# Altium project Gateway.PrjPcb
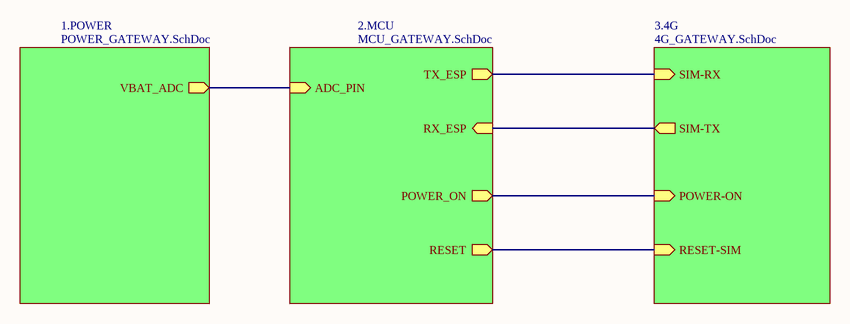
[diagram p0: Gateway.SchDoc]
2 sheets, 53 parts. Net scope: hierarchical (ports join the sheet entries above them; power ports are global).
Board file: Gateway.PcbDoc
Sheets:
  Gateway.SchDoc
    3.4G = 4G_GATEWAY.SchDoc

## Sheet Gateway.SchDoc
size A

### Sub-sheets
1.POWER = POWER_GATEWAY.SchDoc (file not in this document): VBAT_ADC (out)
2.MCU = MCU_GATEWAY.SchDoc (file not in this document): ADC_PIN (in), TX_ESP (out), RX_ESP (in), POWER_ON (out), RESET (out)
3.4G = 4G_GATEWAY.SchDoc: SIM-RX (in), SIM-TX (out), POWER-ON (in), RESET-SIM (in)

### Nets
NetIC1_1: sheet 2.MCU/TX_ESP, sheet 3.4G/SIM-RX
NetIC1_8: sheet 2.MCU/RX_ESP, sheet 3.4G/SIM-TX
NetR8_2: sheet 2.MCU/RESET, sheet 3.4G/RESET-SIM
NetR10_2: sheet 2.MCU/POWER_ON, sheet 3.4G/POWER-ON
(unnamed): sheet 1.POWER/VBAT_ADC, sheet 2.MCU/ADC_PIN

## Sheet 4G_GATEWAY.SchDoc
size A4
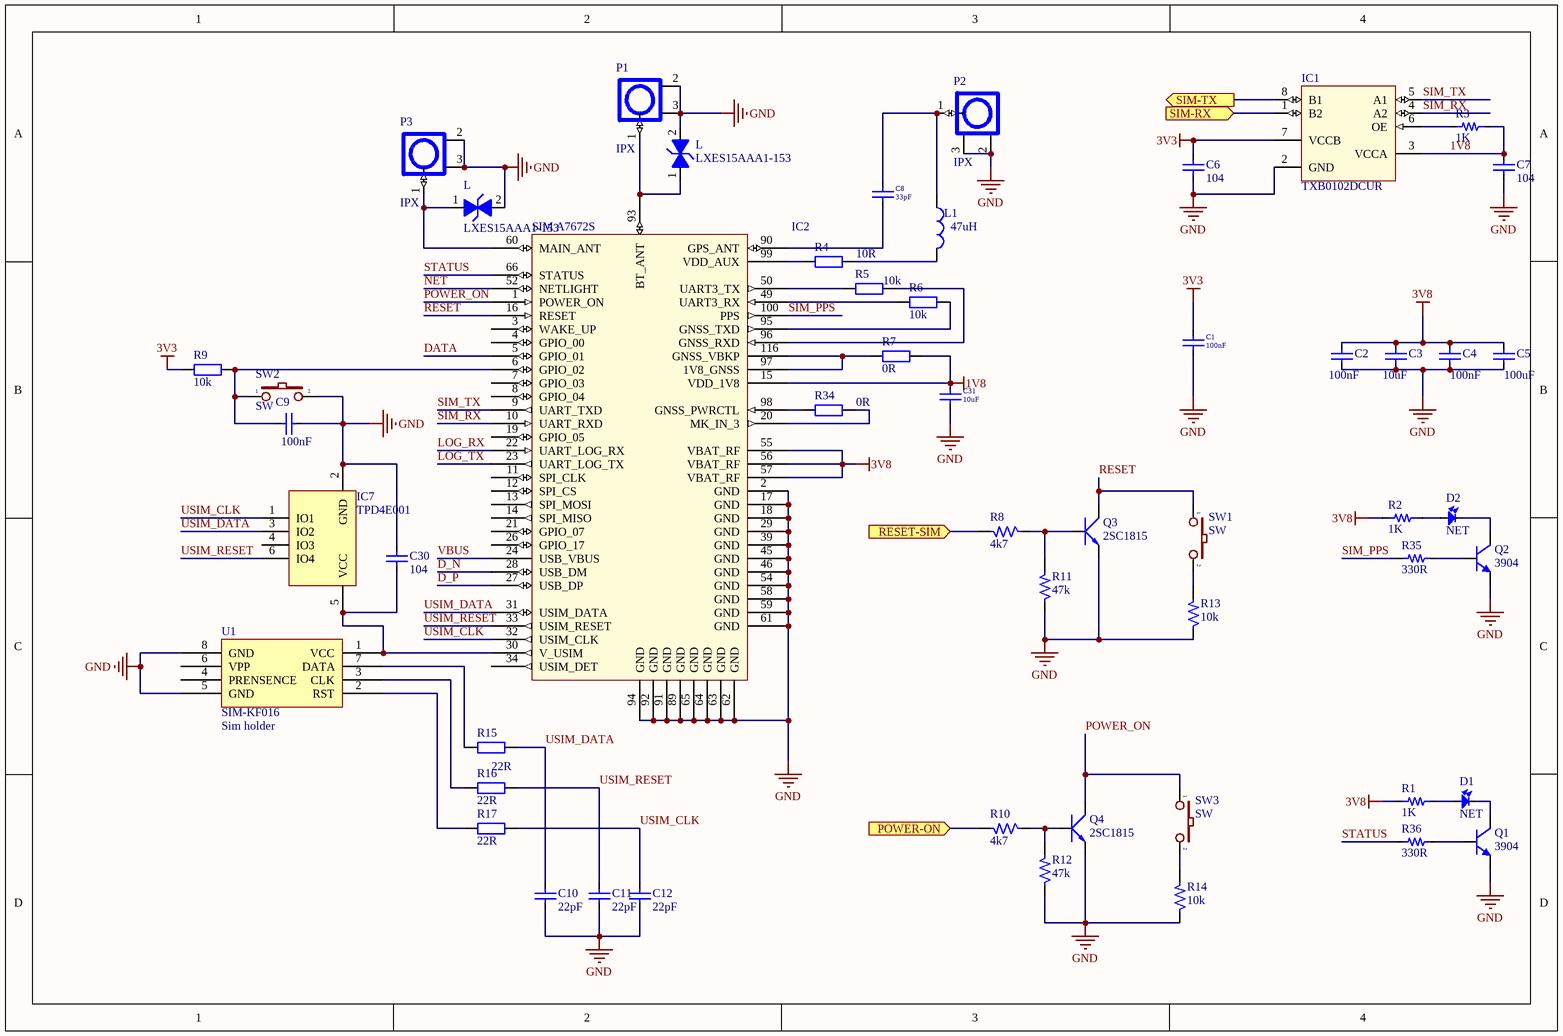
[diagram p1: 4G_GATEWAY.SchDoc]

### Parts
(Parts that share a designator on the sheet are numbered #1, #2 ... from top to bottom, then left to right.)
C1  100nF  [CAP_0805]
C2  100nF  [CAP_0805]
C3  10uF  [CAP_0805]
C4  100nF  [CAP_0805]
C5  100uF  [CAP_0805]
C6  104  [CAP_0805]
C7  104  [CAP_0805]
C8  33pF  [CAP_0805]
C9  100nF  [CAP_0805]
C10  22pF  [CAP_0805]
C11  22pF  [CAP_0805]
C12  22pF  [CAP_0805]
C30  104  [CAP_0805]
C31  10uF  [CAP_0805]
D1  NET  [LED-0805-Blue]
D2  NET  [LED-0805-Blue]
IC1  TXB0102DCUR  [SOP50P310X90-8N]
IC2  SIM A7672S  [A7672S]
IC7  TPD4E001  [SOT23-6]
L1  47uH  [Inductor_SMD]
L#1  LXES15AAA1-153  [INDC1005X45]
L#2  LXES15AAA1-153  [INDC1005X45]
P1  IPX  [IPXS]
P2  IPX  [IPXS]
P3  IPX  [IPXS]
Q1  3904  [SOT23]
Q2  3904  [SOT23]
Q3  2SC1815  [SOT23]
Q4  2SC1815  [SOT23]
R1  1K  [RES-SMD-0805]
R2  1K  [RES-SMD-0805]
R3  1K  [RES-SMD-0805]
R4  10R  [RES-SMD-0805]
R5  10k  [RES-SMD-0805]
R6  10k  [RES-SMD-0805]
R7  0R  [RES-SMD-0805]
R8  4k7  [RES-SMD-0805]
R9  10k  [RES-SMD-0805]
R10  4k7  [RES-SMD-0805]
R11  47k  [RES-SMD-0805]
R12  47k  [RES-SMD-0805]
R13  10k  [RES-SMD-0805]
R14  10k  [RES-SMD-0805]
R15  22R  [RES-SMD-0805]
R16  22R  [RES-SMD-0805]
R17  22R  [RES-SMD-0805]
R34  0R  [RES-SMD-0805]
R35  330R  [RES-SMD-0805]
R36  330R  [RES-SMD-0805]
SW1  SW  [SW-SMD]
SW2  SW  [SW-SMD]
SW3  SW  [SW-SMD]
U1  SIM-KF016  value Sim holder  [SIM_MicroSIM 6P Flip]

### Ports
POWER-ON (in), RESET-SIM (in), SIM-RX (in), SIM-TX (out)

### Nets
1V8: C7.2 C31.2 IC1.3(VCCA) IC2.15(RESERVED) R3.2 R7.1
3V3: C1.2 C6.2 IC1.7(VCCB) R9.2
3V8: C2.2 C3.2 C4.2 C5.2 IC2.55(VBAT_RF) IC2.56(VBAT_RF) IC2.57(VBAT_RF) R1.1 R2.1
GND: C1.1 C2.1 C3.1 C4.1 C5.1 C6.1 C7.1 C9.1 C10.2 C11.2 C12.2 C30.1 C31.1 IC1.2(GND) IC2.2(GND) IC2.17(GND) IC2.18(GND) IC2.29(KEYPAD_0) IC2.39(GND) IC2.45(GND) IC2.46(ADC2) IC2.54(GPIO4) IC2.58(GND) IC2.59(GND) IC2.61(GND) IC2.62(GND) IC2.63(GND) IC2.64(GND) IC2.65(GND) IC2.89(GND) IC2.91(GND) IC2.92(GND) IC2.94(GND) IC7.2(GND) L#1.2 L#2.2 P1.2 P1.3 P2.2 P2.3 P3.2 P3.3 Q1.2(E) Q2.2(E) Q3.1(E) Q4.1(E) R11.1 R12.1 R13.1 R14.1 SW2.2 U1.5(GND) U1.8(GND)
D_N: IC2.28(KEYSENSE_N0)
D_P: IC2.27(KEYSENSE_N1)
DATA: IC2.5(GPIO_01)
LOG_RX: IC2.22(SPK_P)
LOG_TX: IC2.23(MIC1P)
NET: IC2.52(GPIO41)
POWER_ON: IC2.1(POWER_ON) Q4.2(C) SW3.1
RESET: IC2.16(RESERVED) Q3.2(C) SW1.1
SIM_PPS: IC2.100(PPS) R35.1
SIM_RX: IC1.4(A2) IC2.10(UART_RXD)
SIM_TX: IC1.5(A1) IC2.9(UART_TXD)
STATUS: IC2.66(STATUS) R36.1
USIM_CLK: C12.1 IC2.32(KEYSENSE_N3) IC7.1(IO1) R17.1
USIM_DATA: C10.1 IC2.31(KEYSENSE_N2) IC7.3(IO2) R15.1
USIM_RESET: C11.1 IC2.33(KEYPAD_1) IC7.6(IO4) R16.1
VBUS: IC2.24(MIC1N)
NetC8_1: C8.1 IC2.90(GPS_ANT)
NetC8_2: C8.2 L1.1 P2.1
NetC9_2: C9.2 IC2.6(GPIO_02) R9.1 SW2.1
NetC30_2: C30.2 IC2.30(KEYPAD_2) IC7.5(VCC) U1.1(VCC)
NetD1_1: D1.1 R1.2
NetD1_2: D1.2 Q1.3(C)
NetD2_1: D2.1 R2.2
NetD2_2: D2.2 Q2.3(C)
NetIC1_1: IC1.1(B2) ; port SIM-RX
NetIC1_6: IC1.6(OE) R3.1
NetIC1_8: IC1.8(B1) ; port SIM-TX
NetIC2_20: IC2.20(MK_IN_3) R34.1
NetIC2_49: IC2.49(GPIO40) R6.2
NetIC2_50: IC2.50(GPIO43) R5.2
NetIC2_60: IC2.60(MAIN_ANT) L#2.1 P3.1
NetIC2_93: IC2.93(BT_ANT) L#1.1 P1.1
NetIC2_95: IC2.95(GNSS_TXD) R6.1
NetIC2_96: IC2.96(GNSS_RXD) R5.1
NetIC2_97: IC2.97(1V8_GNSS) IC2.116(GNSS_VBKP) R7.2
NetIC2_98: IC2.98(GNSS_PWRCTL) R34.2
NetIC2_99: IC2.99(VDD_AUX) R4.2
NetL1_2: L1.2 R4.1
NetQ1_1: Q1.1(B) R36.2
NetQ2_1: Q2.1(B) R35.2
NetQ3_3: Q3.3(B) R8.1 R11.2
NetQ4_3: Q4.3(B) R10.1 R12.2
NetR8_2: R8.2 ; port RESET-SIM
NetR10_2: R10.2 ; port POWER-ON
NetR13_2: R13.2 SW1.2
NetR14_2: R14.2 SW3.2
NetR15_2: R15.2 U1.7(DATA)
NetR16_2: R16.2 U1.3(CLK)
NetR17_2: R17.2 U1.2(RST)

Not connected (* = marked no-connect by the designer): IC2 3(WAKE_UP) 4(GPIO_00) 7(GPIO_03) 8(GPIO_04) 11(SPI_CLK) 12(SPI_CS) 13(SPI_MOSI) 14(SPI_MISO) 19(GPIO_05) 21(SPK_M) 25(EAR1N) 26(EAR1P) 34(KEYPAD_4) 35(KEYPAD_3) 36(KEYSENSE_N4) 47(ADC1) 48(GPIO44) 51(GPIO1) 53(GPIO42) 73(PCM_DOUT) 74(PCM_DIN) 75(PCM_SYNC) 76(PCM_CLK); IC7 4(IO3); U1 4(PRENSENCE) 6(VPP)

### Library data of the parts
C1 = CapSMD_5: Capacitor; Value: 33p; Published: 8-Jun-2000; LatestRevisionDate: 17-Jul-2002; LatestRevisionNote: Re-released for DXP Platform.; PackageReference: RAD-0.3; Publisher: Altium Limited
C2-C7 = CapSMD_9: Capacitor; Value: 33p; Published: 8-Jun-2000; LatestRevisionDate: 17-Jul-2002; LatestRevisionNote: Re-released for DXP Platform.; PackageReference: RAD-0.3; Publisher: Altium Limited
C8 C31 = CapSMD_1: Capacitor; Value: 33p; Published: 8-Jun-2000; LatestRevisionDate: 17-Jul-2002; LatestRevisionNote: Re-released for DXP Platform.; PackageReference: RAD-0.3; Publisher: Altium Limited
C9-C12 C30 = CapSMD: Capacitor; Value: 33p; Published: 8-Jun-2000; LatestRevisionDate: 17-Jul-2002; LatestRevisionNote: Re-released for DXP Platform.; PackageReference: RAD-0.3; Publisher: Altium Limited
D1 D2 = LED_2: LED Single colour Green and Red; Value: LED 3 ly Single Colour
IC1 = TXB0102DCUR: IC TRNSLTR BIDIRECTIONAL US8; Manufacturer: Texas Instruments; Category: IC Logic Level; Package: 8-VSSOP; Part number: TXB0102DCUR; User_Description: IC TRNSLTR BIDIRECTIONAL US8
IC2 = SIM A7672S: SIM A7672S-CAT-M1; Part number: SIM A7672S
IC7 = TPD4E001_1: Manufacturer: Texas Instruments; Part number: TPD4E001RDBVR; User_Description: TVS DIODE 5.5VWM SC70-6; Category: Circuit Protection; Package: SOT-363
L1 = L1: 22µH Shielded Inductor 1.65A 96mOhm Max Nonstandard; Manufacturer: Bourns Inc.; Part Number: SRR0745A-220M; Value: 220uH; User_Description: FIXED IND 22UH 1.65A 96 MOHM SMD; Category: INDUCTORS; Package: SMD
L#1 L#2 = LXES15AAA1-153: Clamp Ipp Tvs Diode Surface Mount 1005; MF: Murata; SnapEDA_Link: https://www.snapeda.com/parts/LXES15AAA1-153/Murata%20Electronics%20North%20America/view-part/653473/?ref=snap; MP: LXES15AAA1-153; Value: *; Digi-Key_Part_Number: 490-13210-1-ND; Digi-Key_Purchase_URL: https://www.digikey.kr/product-detail/en/murata-electronics/LXES15AAA1-153/490-13210-1-ND/5843764?utm_source=snapeda&utm_medium=aggregator&utm_campaign=symbol; Package: 0402 Murata
P1-P3 = IPXSx66: Antenna GSM GPS; Manufacturer: TE Connectivity AMP Connectors; Part number: 2334884-1; User_Description: UMCC MICRO-COAX RECEPTACLE, GEN; Category: Connectors; Package: SMD
Q1 Q2 = MMBT3904
Q3 Q4 = 2SC1815: NPN 600mW, ECB; Value: C1815
R1-R3 R35 R36 = Resistor - SMD: Resistor; Manufacturer: Generic Components; Class: Passive; Published: 08/06/2000; Publisher: Altium Hobart Technology Centre
R4-R7 R9 R15-R17 R34 = Resistor - SMD: Resistor SMD; Manufacturer: Generic Components; Class: Passive; Published: 08/06/2000; Publisher: Altium Hobart Technology Centre
R8 R10-R14 = R: Resistor 1/4W; Value: R1/4W - 1K
SW1-SW3 = SW2: Switch button 2 pin; Value: SW chip 2 pin
U1 = Sim holder: SIM Card Holder KF-016